# Altium schematic sheet PMIC_Watchdog.SchDoc
size 420 x 297 mm; SheetNumber: 15; SheetTotal: 23
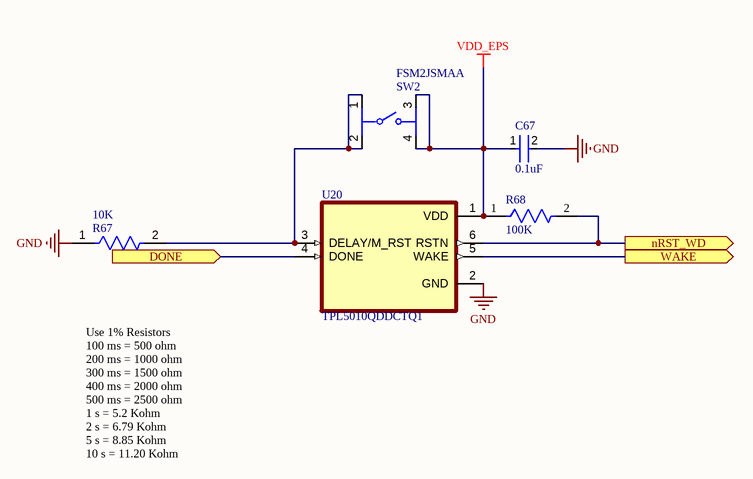
[diagram p0: PMIC_Watchdog.SchDoc]

## Parts
C67  0.1uF  [FP-C0603C-CF-MFG]
R67  10K  [FP-RK73B1J-MFG]
R68  100K  [FP-ERA3A-MFG]
SW2  FSM2JSMAA  [FP-FSM2JSMAA-MFG]
U20  TPL5010QDDCTQ1  [SOT95P280X110-6N]

## Ports
DONE (in), nRST_WD (out), WAKE (out)

## Nets
GND: C67.2 R67.1 U20.2(GND)
VDD_EPS: C67.1 R68.1 SW2.3 SW2.4 U20.1(VDD)
DONE: U20.4(DONE) ; port DONE
nRST_WD: R68.2 U20.6(RSTN) ; port nRST_WD
WAKE: U20.5(WAKE) ; port WAKE
NetR67_2: R67.2 SW2.1 SW2.2 U20.3(DELAY/M_RST)

## Notes on the sheet
- Use 1% Resistors
  100 ms = 500 ohm
  200 ms = 1000 ohm
  300 ms = 1500 ohm
  400 ms = 2000 ohm
  500 ms = 2500 ohm
  1 s = 5.2 Kohm
  2 s = 6.79 Kohm
  5 s = 8.85 Kohm
  10 s = 11.20 Kohm
- THIS DOCUMENT AND THE DATA DISCLOSED HEREIN OR
- HEREWITH IS THE PROPERTY OF ALTIUM LIMITED AND MAY
- DWG NO:
- REVISION
- REV:
- DESCRIPTION
- DATE
- APPROVED
- BE FREELY DISTRIBUTED IN WHOLE. NO RIGHTS ARE
- RESERVED OR EXPRESS OR IMPLIED WARANTEE GIVEN.
- ENG:
- APPROVALS
- PROJECT
- DSN:
- CHK:
- REFERENCE DOCUMENTS
- PROJECT REVISION:
- TITLE
- DOCUMENT REVISION:
- DESIGN ITEM:
- BOM:
- FAB DWG:
- PCB DWG:
- ASSY DWG:
- SCALE:
- A3
- SIZE
- CAGE CODE
- FILE NAME
- DWG NO.
- SHEET
- OF
- REV

## Library data of the parts
C67 = CMP-2006-03061-2: CAP CER 0.1UF 50V X7R 0603; Manufacturer: KEMET; Manufacturer Part Number: C0603C104K5RACTU; Tolerance: 0.1; Temperature Coefficient: 30ppm/°C; Material: Ceramic; Automotive Grade: Grade 1; Value: 0.10 μF; Temperature: -55°C to +125°C; RoHS: TRUE; Temperature Range High: +125°C; Lead Free: Yes; Octopart: https://octopart.com/c0603c104k5ractu-kemet-139244; Digikey Description: CAP CER 0.1UF 50V X7R 0603; Category: Cap; Package: C0603C-CF; ComponentLink2Description: Datasheet; Temperature Range Low: -55°C; Device Class L1: Passive Components; Voltage Rating: 50 V; Automotive: Yes; Device Class L3: Ceramic Capacitors; ComponentLink2URL: https://api.kemet.com/component-edge/download/datasheet/C0603C100J5GACAUTO.pdf; Capacitance: 0.10 μF; Device Class L2: Capacitors; Temperature Characteristic: X7R; Height: 0.87mm
R67 = CMP-2000-01851-2: RES 10K OHM 5% 1/10W 0603; Temperature Coefficient: 200ppm/°C; Voltage Rating: 50V; Power Rating: 100mW; Resistance: 10kR; Length: 1.6mm; Lead Free: Lead Free; Resistance Tolerance: 5%; Case Code (Metric): 1608; Width: 0.8mm; Height: 0.45mm; Max Operating Temperature: 155°C; RoHS Compliant: Yes; Resistor Type: Thick Film; Min Operating Temperature: -55°C; Case Code (Imperial): 0603; Technology: THICK FILM; Package Quantity: 5000; Tolerance: 5%; Case/Package: 0603; Voltage Rating (DC): 50V; Depth: 0.8mm; Packaging: Tape and Reel; Number of Pins: 2; Construction: Rectangular; Series: RK73B; Military Standard: Not; Termination: SMD/SMT
R68 = CMP-2000-00875-2: NexarPartId: 1243428; Power Rating: 100mW; Voltage Rating (DC): 75V; Tolerance: 0.1%; Temperature Coefficient: 25ppm/°C; Resistance: 100kΩ; Contact Plating: Tin; Max Operating Temperature: 155°C; Case Code (Imperial): 0603; Packaging: Cut Tape; Width: 800µm; Lead Free: Lead Free; REACH SVHC: No SVHC; Termination: SMD/SMT; Radiation Hardening: No; Length: 1.6mm; Military Standard: Not; Features: Automotive AEC-Q200; Case/Package: 0603; Number of Terminations: 2; Composition: Thin Film; Schedule B: 8533210045, 8533210045; Voltage Rating: 75V; Mount: Surface Mount; Case Code (Metric): 1608; Lifecycle Status: Production; Height: 450µm; RoHS: Compliant; Number of Pins: 2; Max Power Dissipation: 100mW; Min Operating Temperature: -55°C; Depth: 800µm; Working Voltage: 75V
SW2 = CMP-03402-000003-1: SWITCH TACTILE SPST-NO 0.05A 24V; Manufacturer: TE Connectivity; Standoff Height: 0.05mm; Contact Current Rating: 50mA; Electromechanical Life: 100000Cycles; Operating Force: 260gf; Contact Resistance: 100mΩ; Package: 0; Temperature Range High: +85°C; Temperature: -35°C to +85°C; Category: Switch; Manufacturer Part Number: FSM2JSMAA; RoHS: TRUE; Mouser Description: Tactile Switches TACTILE 260G FORCE S; Device Class L1: Electromechanical; Mount: Surface Mount; Height: 4.59mm; ComponentLink2URL: https://www.te.com/commerce/DocumentDelivery/DDEController?Action=showdoc&DocId=Customer+Drawing%7F2-1437565-7%7FV%7Fpdf%7FEnglish%7FENG_CD_2-1437565-7_V.pdf%7F2-1437565-8; Temperature Range Low: -35°C; Voltage Rating Dc: 24V; Lead Free: Yes; Automotive: No; Throw Configuration: SPST-NO; Octopart: https://octopart.com/fsm2jsmaa-te+connectivity-41720620; Device Class L2: Switches; Device Class L3: Pushbutton Switches; ComponentLink2Description: Datasheet; Digikey Description: SWITCH TACTILE SPST-NO 0.05A 24V
U20 = CMP-049-000000-1: Automotive AEC-Q100, nano-powered system timer with watchdog function; MF: Texas Instruments; MP: TPL5010QDDCTQ1; Check_prices: https://www.snapeda.com/parts/TPL5010QDDCTQ1/Texas+Instruments/view-part/?ref=eda; Source: TPL5010QDDCTQ1.SchLib; Package: SOT-23-THN-6 Texas Instruments; SnapEDA_Link: https://www.snapeda.com/parts/TPL5010QDDCTQ1/Texas+Instruments/view-part/?ref=snap; Component Type: Standard; Value: *; Pin Count: 6; Design Item ID: TPL5010QDDCTQ1